# EasyEDA Pro project 20250513.epro, schematic Schematic3
Create Date: 2023-11-01; Page Name: P1; Project Name: Maglev-v1; Schematic Name: Schematic3; Update Date: 2024-04-15; Company: Matrixchung; Page Size: A4; Version: V1.0
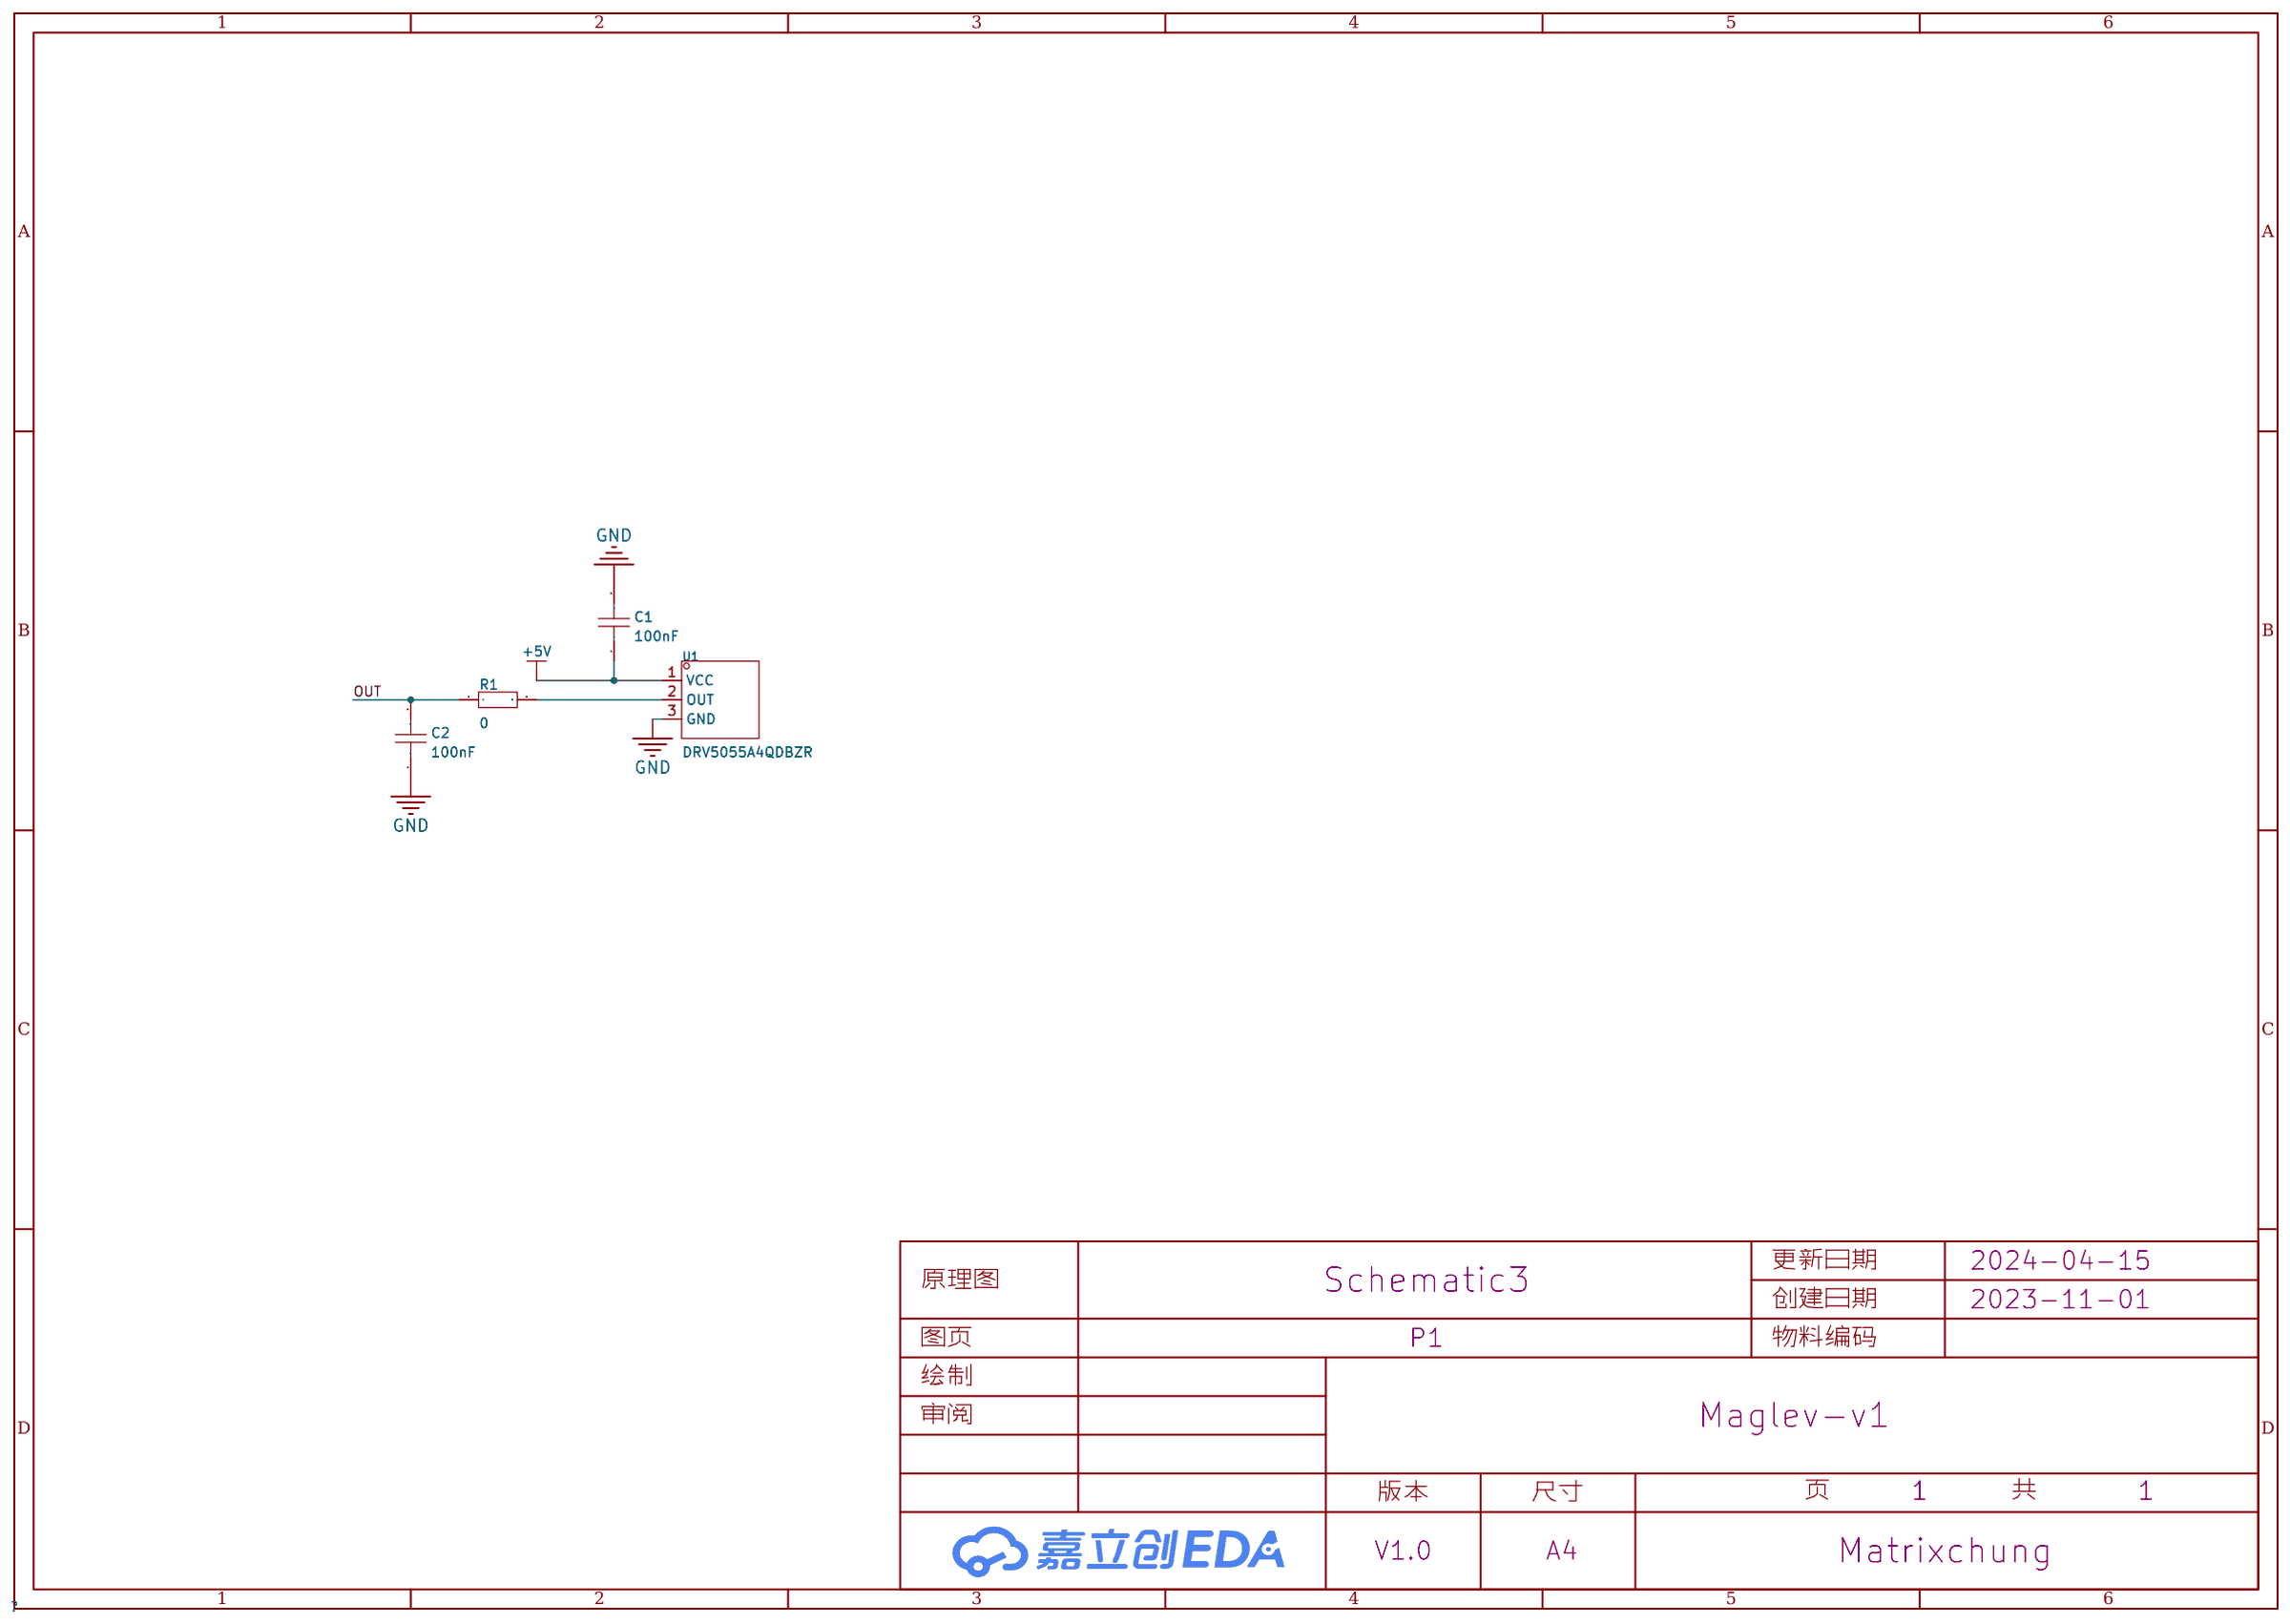
[diagram p1: schematic sheet]

## Parts
C1  100nF  [C0603]
C2  100nF  [C0603]
R1  0  [R0603]
U1  DRV5055A4QDBZR  [SOT-23-3_L2.9-W1.3-P1.90-LS2.4-BR]

## Library data of the parts
C1 C2 = CAP_0603: Supplier Footprint: 0603
R1 = Res_0603: Supplier Footprint: 0603
U1 = DRV5055A4QDBZR: DRV5055 高精度 3.3V 或 5V 比例式双极霍尔效应传感器系列; LCSC Part Name: 线性霍尔效应传感器; Supplier Part: C266123; Manufacturer: TI(德州仪器); Supplier Footprint: SOT-23; JLCPCB Part Class: 扩展库; Datasheet: https://www.ti.com/cn/lit/gpn/drv5055; Supplier: LCSC; supply voltage: 3V~3.63V；4.5V~5.5V; Operating Temperature: -40℃~+125℃

## Nets
+5V: C1.1 U1.1(VCC)
GND: C1.2 C2.1 U1.3(GND)
OUT: C2.2 R1.1
$1N334: R1.2 U1.2(OUT)
